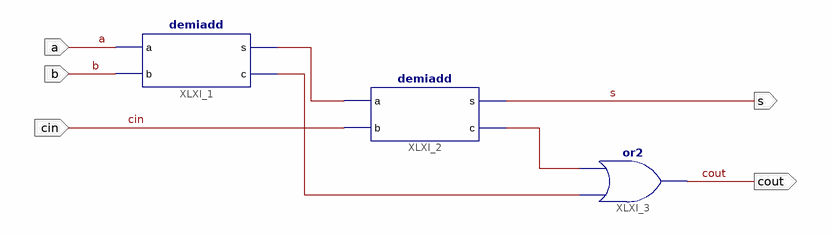
[diagram p0: schematic sheet 1]
// Xilinx ISE schematic add1bit.sch (spartan3e) as structural Verilog: 3 symbols, 5 ports
module add1bit (
  input  a,
  input  cin,
  input  b,
  output cout,
  output s
);

  wire XLXN_3, XLXN_6, XLXN_9;

  demiadd XLXI_1 (.a(a), .b(b), .s(XLXN_3), .c(XLXN_9));
  demiadd XLXI_2 (.a(XLXN_3), .b(cin), .s(s), .c(XLXN_6));
  or XLXI_3 (cout, XLXN_9, XLXN_6);
endmodule
